# Altium schematic sheet SCH_Modules.SchDoc
size A4
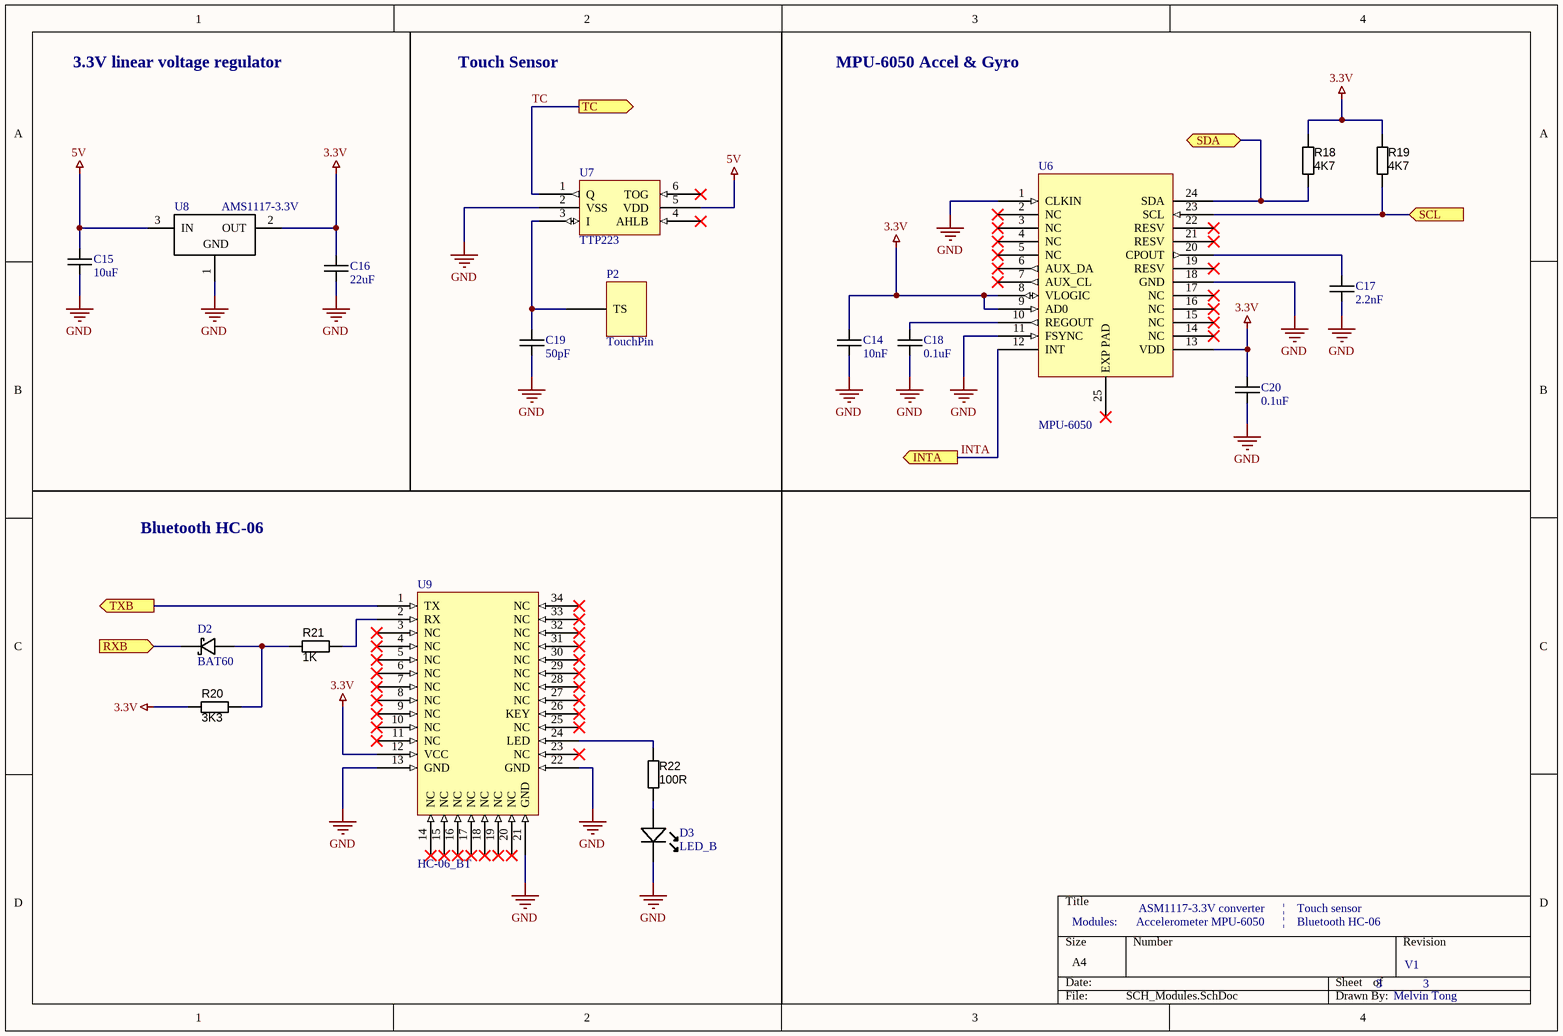
[diagram p0: SCH_Modules.SchDoc]

## Parts
C14  10nF  [CAP_0805]
C15  10uF  [CAP_1206]
C16  22uF  [CAP_1206]
C17  2.2nF  [CAP_0805]
C18  0.1uF  [CAP_0805]
C19  50pF  [CAP_0805]
C20  0.1uF  [CAP_0805]
D2  BAT60  [SOD323]
D3  LED_B  [LED_0805]
P2  TouchPin  [TouchPad]
R18  4K7  [RESC3216X70N]
R19  4K7  [RESC3216X70N]
R20  3K3  [RESC3216X70N]
R21  1K  [RESC3216X70N]
R22  100R  [RESC3216X70N]
U6  MPU-6050  [MPU-6050]
U7  TTP223  [TTP223-BA6]
U8  AMS1117-3.3V  [SOT223]
U9  HC-06_BT  [HC-06_BT]

## Ports
INTA (out), RXB (in), SCL (in), SDA (bidir), TC (out), TXB (out)

## Nets
3.3V: C14.2 C16.1 C20.2 R18.1 R19.1 R20.1 U6.8(VLOGIC) U6.9(AD0) U6.13(VDD) U8.2(OUT) U9.12(VCC)
5V: C15.1 U7.5(VDD) U8.3(IN)
GND: C14.1 C15.2 C16.2 C17.2 C18.1 C19.2 C20.1 D3.K U6.1(CLKIN) U6.11(FSYNC) U6.18(GND) U7.2(VSS) U8.1(ADJ) U9.13(GND) U9.21(GND) U9.22(GND)
INTA: U6.12(INT) ; port INTA
RXB: D2.K ; port RXB
SCL: R19.2 U6.23(SCL) ; port SCL
SDA: R18.2 U6.24(SDA) ; port SDA
TC: U7.1(Q) ; port TC
TXB: U9.1(TX) ; port TXB
NetC17_1: C17.1 U6.20(CPOUT)
NetC18_2: C18.2 U6.10(REGOUT)
NetC19_1: C19.1 P2.1(TS) U7.3(I)
NetD2_A: D2.A R20.2 R21.1
NetD3_A: D3.A R22.2
NetR21_2: R21.2 U9.2(RX)
NetR22_1: R22.1 U9.24(LED)

Not connected (* = marked no-connect by the designer): U6 2(NC)* 3(NC)* 4(NC)* 5(NC)* 6(AUX_DA)* 7(AUX_CL)* 14(NC)* 15(NC)* 16(NC)* 17(NC)* 19(RESV)* 21(RESV)* 22(RESV)* 25(EXP_PAD)*; U7 4(AHLB_)* 6(TOG_)*; U9 3(NC)* 4(NC)* 5(NC)* 6(NC)* 7(NC)* 8(NC)* 9(NC)* 10(NC)* 11(NC)* 14(NC)* 15(NC)* 16(NC)* 17(NC)* 18(NC)* 19(NC)* 20(NC)* 23(NC)* 25(NC)* 26(KEY)* 27(NC)* 28(NC)* 29(NC)* 30(NC)* 31(NC)* 32(NC)* 33(NC)* 34(NC)*

## Notes on the sheet
- 3.3V linear voltage regulator
- Touch Sensor
- MPU-6050 Accel & Gyro
- Bluetooth HC-06
- Modules:
- Accelerometer MPU-6050      |    Bluetooth HC-06
- ASM1117-3.3V converter      |    Touch sensor
- 3
- V1
- Melvin Tong
- (in symbol AMS1117-3.3V) GND

## Library data of the parts
C14 = CAP_10nF: SMD 0805
C15 = CAP_10uF: SMD 0805/1206
C16 = CAP_22uF: SMD 1206
C17 = CAP_2.2nF: SMD 0805
C18 C20 = CAP_0.1uF: SMD 0805
C19 = CAP_50pF: SMD 0805
D2 = BAT60: Schottky Diode 3A, Vf~0.24V, Vr=10V
D3 = LED_B: SMD_0805 3V
R18 R19 = RES_4K7: Resistor SMD, 1206; Value: N/A
R20 = RES_3K3: Resistor SMD, 1206; Value: N/A
R21 = RES_1K: Resistor SMD, 1206; Value: N/A
R22 = RES_100R: Resistor SMD, 1206; Value: N/A